# EAGLE design ESP-01_Tamer-u (EAGLE 7.6.0)
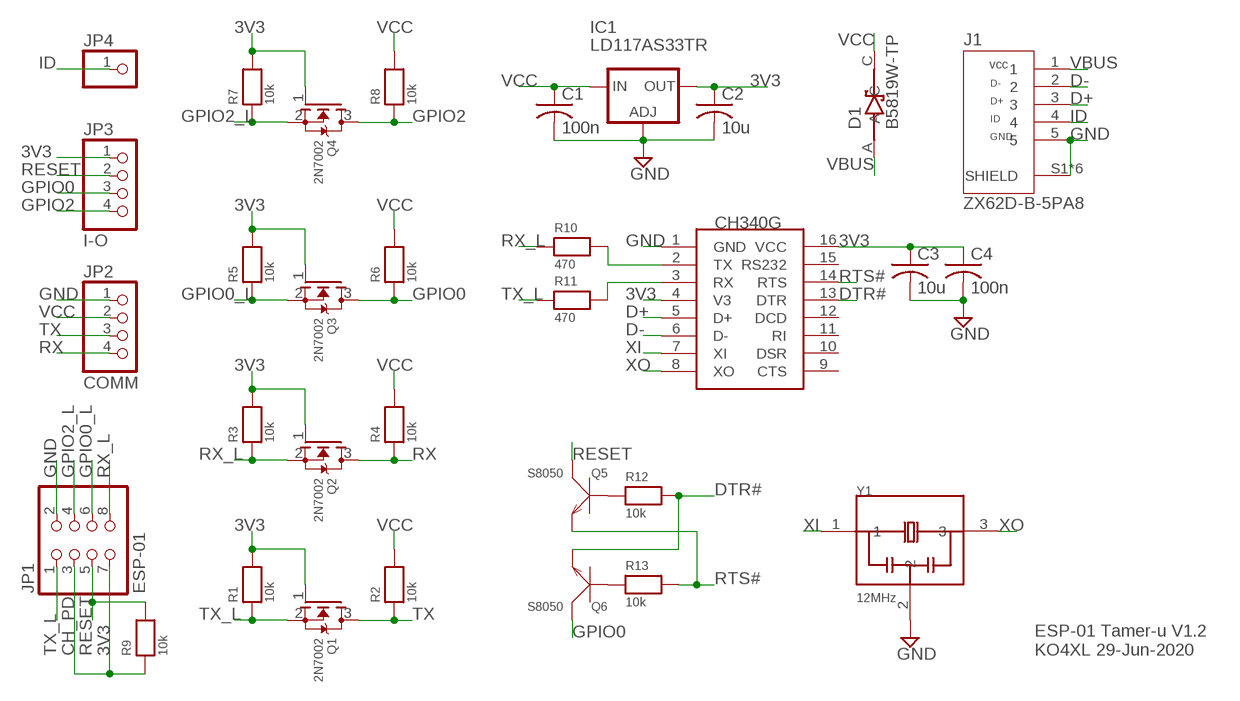
[diagram p0: schematic, sheet 1]

## Parts
C1  100n  C-USC0805K  [C0805K]
C2  10u  C-USC0805K  [C0805K]
C3  10u  C-USC0805K  [C0805K]
C4  100n  C-USC0805K  [C0805K]
D1  B5819W-TP  [SOD3716X135N]
IC1  LD117AS33TR  [SOT223]
IC2  CH340G  [SOIC16]
J1  ZX62D-B-5PA8  [HIROSE_ZX62D-B-5PA8]
JP1  ESP-01  PINHD-2X4  [2X04]
JP2  COMM  HEADER-1X4ROUND  [1X04_ROUND]
JP3  I-O  HEADER-1X4ROUND  [1X04_ROUND]
JP4  HEADER-1X1ROUND  [1X01_ROUND]
Q1  2N7002  MOSFET-NWIDE  [SOT23-WIDE]
Q2  2N7002  MOSFET-NWIDE  [SOT23-WIDE]
Q3  2N7002  MOSFET-NWIDE  [SOT23-WIDE]
Q4  2N7002  MOSFET-NWIDE  [SOT23-WIDE]
Q5  S8050  SMD-TRANSISTORS-NPN-25V-500MW-S8050(SOT-23)  [SOT-23]
Q6  S8050  SMD-TRANSISTORS-NPN-25V-500MW-S8050(SOT-23)  [SOT-23]
R1  10k  RESISTOR0805_NOTHERMALS  [0805_NOTHERMALS]
R2  10k  RESISTOR0805_NOTHERMALS  [0805_NOTHERMALS]
R3  10k  RESISTOR0805_NOTHERMALS  [0805_NOTHERMALS]
R4  10k  RESISTOR0805_NOTHERMALS  [0805_NOTHERMALS]
R5  10k  RESISTOR0805_NOTHERMALS  [0805_NOTHERMALS]
R6  10k  RESISTOR0805_NOTHERMALS  [0805_NOTHERMALS]
R7  10k  RESISTOR0805_NOTHERMALS  [0805_NOTHERMALS]
R8  10k  RESISTOR0805_NOTHERMALS  [0805_NOTHERMALS]
R9  10k  RESISTOR0805_NOTHERMALS  [0805_NOTHERMALS]
R10  470  RESISTOR0805_NOTHERMALS  [0805_NOTHERMALS]
R11  470  RESISTOR0805_NOTHERMALS  [0805_NOTHERMALS]
R12  10k  RESISTOR0805_NOTHERMALS  [0805_NOTHERMALS]
R13  10k  RESISTOR0805_NOTHERMALS  [0805_NOTHERMALS]
Y1  12MHz  CSTCE8M00G55-R0  [OSC_CSTCE8M00G55-R0]

## Nets
3V3: C2.1 C3.1 C4.1 IC1.4(OUT) IC2.4(V3) IC2.16(VCC) JP1.3 JP1.7 JP3.1 Q1.1(G) Q2.1(G) Q3.1(G) Q4.1(G) R1.2 R3.2 R5.2 R7.2 R9.1
D+: IC2.5(D+) J1.3
D-: IC2.6(D-) J1.2
DTR#: IC2.13(DTR) Q6.2(E) R12.2
GND: C1.2 C2.2 C3.2 C4.2 IC1.1(ADJ) IC2.1(GND) J1.5 J1.S1(SHIELD) J1.S2(SHIELD) J1.S3(SHIELD) J1.S4(SHIELD) J1.S5(SHIELD) J1.S6(SHIELD) JP1.2 JP2.1 Y1.2
GPIO0: JP3.3 Q3.3(D) Q6.3(C) R6.1
GPIO0_L: JP1.6 Q3.2(S) R5.1
GPIO2: JP3.4 Q4.3(D) R8.1
GPIO2_L: JP1.4 Q4.2(S) R7.1
ID: J1.4 JP4.1
N$1: Q5.1(B) R12.1
N$2: Q6.1(B) R13.1
N$3: IC2.2(TX) R10.2
N$4: IC2.3(RX) R11.2
RESET: JP1.5 JP3.2 Q5.3(C) R9.2
RTS#: IC2.14(RTS) Q5.2(E) R13.2
RX: JP2.4 Q2.3(D) R4.1
RX_L: JP1.8 Q2.2(S) R3.1 R10.1
TX: JP2.3 Q1.3(D) R2.1
TX_L: JP1.1 Q1.2(S) R1.1 R11.1
VBUS: D1.A J1.1
VCC: C1.1 D1.C IC1.3(IN) JP2.2 R2.2 R4.2 R6.2 R8.2
XI: IC2.7(XI) Y1.1
XO: IC2.8(XO) Y1.3
Unconnected: IC2.9(CTS) IC2.10(DSR) IC2.11(RI) IC2.12(DCD) IC2.15(RS232)

## Notes on the sheet
- CH_PD
- ESP-01 Tamer-u V1.2
  KO4XL 29-Jun-2020

## Library data of the parts
C1-C4 = rcl:C-US: CAPACITOR, American symbol
D1 = SnapEDA:B5819W-TP: Diode Schottky 20v 1a Sod123; AVAILABILITY: Unavailable; DESCRIPTION: Diode Schottky 20v 1a Sod123; MF: Micro Commercial; MP: B5819W-TP; PACKAGE: SOD-123 MCC; PRICE: None
IC1 = v-reg:LD117A?*: Low drop fixed and adjustable positive voltage regulators 1 A Source: http://www.st.com/stonline/products/literature/ds/7194/ld1117axx.pdf
IC2 = ch340g:CH340G
J1 = ZX62D-B-5PA8:ZX62D-B-5PA8: CONN RCPT USB; AVAILABILITY: Unavailable; DESCRIPTION: USB - micro B USB 2.0 Receptacle Connector 5 Position Surface Mount, Right Angle; Through Hole; MF: Hirose; MP: ZX62D-B-5PA8; PACKAGE: None; PRICE: None
JP1 = pinhead:PINHD-2X4: PIN HEADER
JP2 JP3 = microbuilder:HEADER-1X4: PIN HEADER
JP4 = microbuilder:HEADER-1X1: PIN HEADER
Q1-Q4 = microbuilder:MOSFET-N: N-Channel Mosfet LEGEND VDS: Voltage Drain-Source ID: Drain Current RDS(ON): Drain-Source On-State Resistance VGS(TH): Gate-Source Threshold Voltage CISS: Drain-Source Input Capacitance SOT-23 Name VDS ID RDS(ON) VGS(TH) CISS Order Number 2N7002E 60V 260mA 2.5 Ohm 2.5V @ 250uA 26.7pF @ 25V 2N7002ET1GOSTR-ND BSH103 30V 850mA 400 mOhm 400mV @ 1mA 83pF @ 24V BSH103,235-ND BSS138 60V 320mA 1.6 Ohm 1.5V @ 250uA 50pF @ 10V Mouser: 771-BSS138PW115 DMN2075U-7 20V 4.2A 38 mOhm 1V @ 250 uA 594.3pF @ 10V DMN2075U-7DICT-ND * BSS138 good choice for I2C level-shifting
Q5 Q6 = SnapEDA:SMD-TRANSISTORS-NPN-25V-500MW-S8050(SOT-23): 305010017; AVAILABILITY: Unavailable; DESCRIPTION: SMD Transistors NPN 25V-500mW;; MF: JCET; MP: S8050; PACKAGE: SOT-23-3 JCET; PRICE: None
R1-R13 = microbuilder:RESISTOR: Resistors 0402 - 0402 Surface Mount Package 22 Ohm 1% 1/16W [Digikey: 311-22.0LRTR-ND] 33 Ohm 5% 1/16W 1.0K 5% 1/16W 1.5K 5% 1/16W 2.0K 1% 1/16W 10.0K 1% 1/16W [Digikey: 311-10.0KLRTR-ND] 10.0K 5% 1/16W [Digikey: RMCF0402JT10K0TR-ND] 12.1K 1% 1/16W [Digikey: 311-22.0LRTR-ND] 100.0K 5% 1/16W 0603 - 0603 Surface Mount Package 0 Ohm 1/10 Watt 1% Resistor 15 Ohm 1/10 Watt 1% Resistor 33 Ohm 1/10 Watt 1% Resistor 49.9 Ohm 1/10 Watt 1% Resistor 100 Ohm 1/10 Watt 1% Resistor 150 Ohm 1/10 Watt 1% Resistor 240 Ohm 1/10 Watt 1% Resistor 390 Ohm 1/10 Watt 1% Resistor 560 Ohm 1/10 Watt 1% Resistor 680 Ohm 1/10 Watt 1% Resistor 750 Ohm 1/10 Watt 1% Resistor 1.0K Ohm 1/10 Watt 1% Resistor 1.5K Ohm 1/10 Watt 1% Resistor 2.0K Ohm 1/10 Watt 1% Resistor 2.2K Ohm 1/10 Watt 1% Resistor 3.3K Ohm 1/10 Watt 1% Resistor 4.7K Ohm 1/10 Watt 1% Resistor 10.0K Ohm 1/10 Watt 1% Resistor 12.0K Ohm 1/10 Watt 1% Resistor 12.1K Ohm 1/10 Watt 1% Resistor 20.0K Ohm 1/10 Watt 1% Resistor 33.0K Ohm 1/10 Watt 1% Resistor 100.0K Ohm 1/10 Watt 1% Resistor 0805 - 0805 Surface Mount Package 0 Ohm 1/8 Watt 1% Resistor 33 Ohm 1/8 Watt 1% Resistor 100 Ohm 1/8 Watt 1% Resistor 150 Ohm 1/8 Watt 1% Resistor 200 Ohm 1/8 Watt 1% Resistor 240 Ohm 1/8 Watt 1% Resistor 330 Ohm 1/8 Watt 1% Resistor 390 Ohm 1/8 Watt 1% Resistor 470 Ohm 1/8 Watt 1% Resistor 1.0K Ohm 1/8 Watt 1% Resistor 1.5K Ohm 1/8 Watt 1% Resistor 2.0K Ohm 1/8 Watt 1% Resistor 4.7K Ohm 1/8 Watt 1% Resistor 5.1K Ohm 1/8 Watt 1% Resistor 5.6K Ohm 1/8 Watt 1% Resistor 10.0K Ohm 1/8 Watt 1% Resistor 22.0K Ohm 1/8 Watt 1% Resistor 33.0K Ohm 1/8 Watt 1% Resistor 100K Ohm 1/8 Watt 1% Resistor 1206 - 1206 Surface Mount Package 2012 - 2010 Surface Mount Package 0.11 Ohm 1/2 Watt 1% Resistor - Digikey: RHM.11UCT-ND
Y1 = SnapEDA:CSTCE8M00G55-R0: SMD Crystal 8MHz -0.3%-150R; AVAILABILITY: Unavailable; DESCRIPTION: Ceramic Resonator 8MHz ??0.5% _Tol_ ??0.2% _Stability_ 33pF 40Ohm 3-Pin CSMD T/R; MF: Murata; MP: CSTCE8M00G55-R0; PACKAGE: SMD-3 Murata; PRICE: None

## Net classes
0 default: width 0.254 mm, drill 0.254 mm, clearance 0.254 mm

## Board
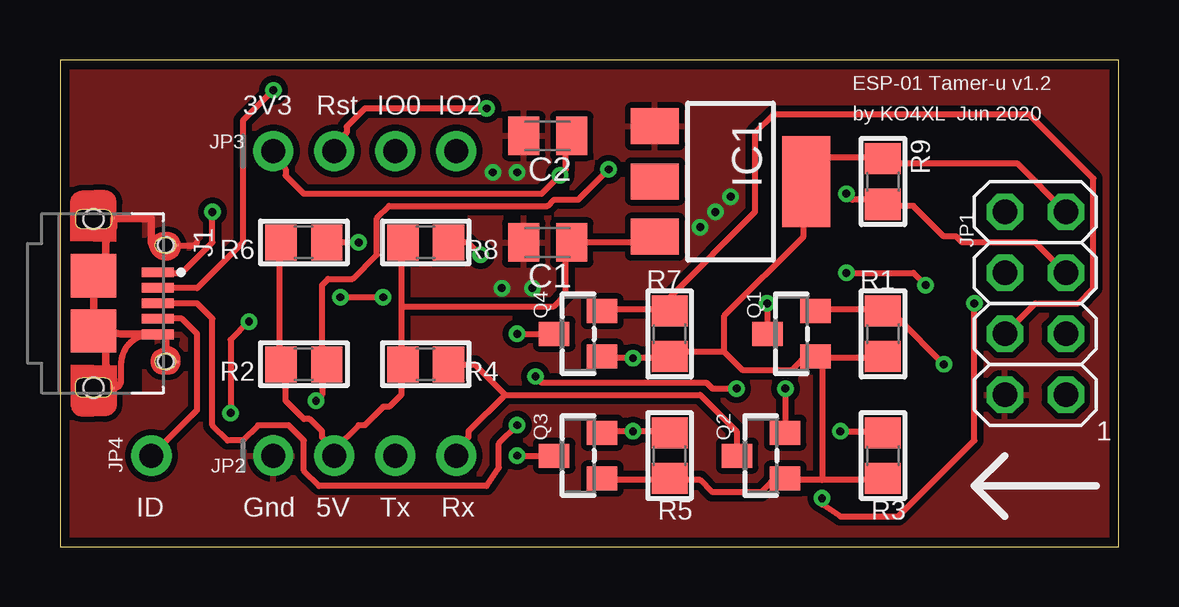
[diagram p1: board, top side]
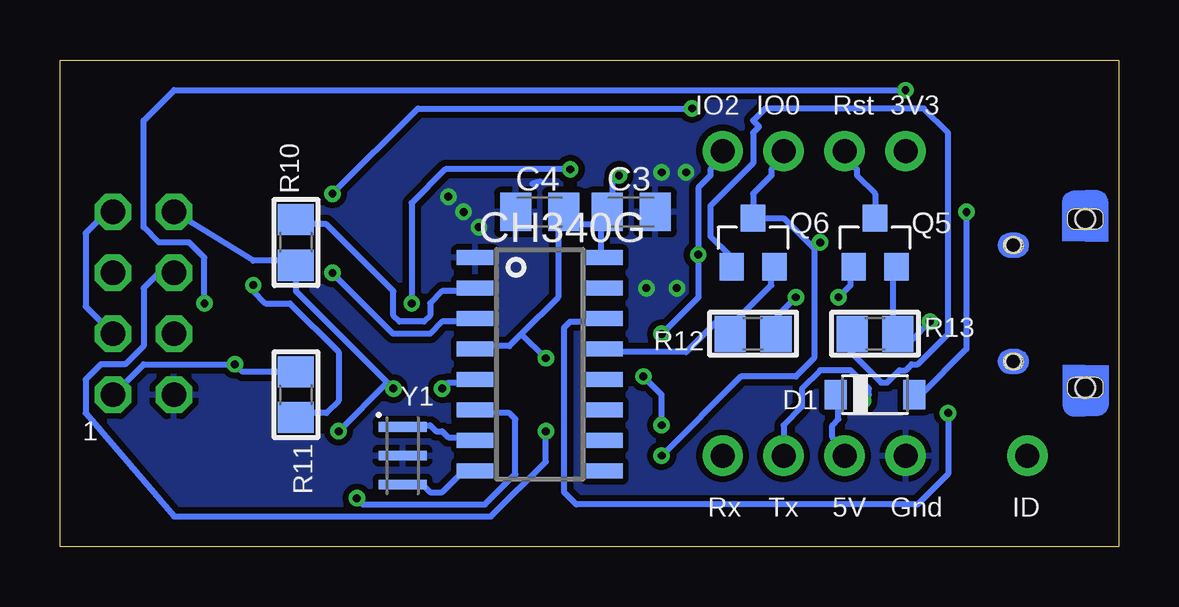
[diagram p2: board, bottom side, seen from below]

Size 44.12 x 20.31 mm. Coordinates in mm from the lower left corner, seen from the top.
Outline: 0,0 44.12,0 44.12,20.31 0,20.31 0,0
Copper layers (1*16): Top 0.0356mm / dielectric 1.5011mm / Bottom 0.0356mm
Design rules "OSHPark": minimum track width 6mil, minimum drill 13mil, track to track 6mil, track to pad 6mil, pad to pad 6mil, via to via 6mil, smd to smd 6mil, copper to edge 15mil, drill to drill 6mil, minimum pad ring 7mil, minimum via ring 7mil, stop-mask expansion 4mil, vias tented up to drill 0mil, thermal gap 10mil

### Footprints (pad centres in the part's own frame; a part is rotated, then mirrored left to right if it is on the bottom)
C0805K = smd 1.3 x 1.6: 1 -1,0; 2 1,0
SOD3716X135N = smd 0.914 x 1.219: A 1.638,0; C -1.638,0
SOT223 = smd 1.5 x 2: 1 -2.3,-3.15; 2 0,-3.15; 3 2.3,-3.15 | smd 3.8 x 2: 4 0,3.15
SOIC16 = smd 0.635 x 1.524: 1 -4.445,-2.695; 2 -3.175,-2.695; 3 -1.905,-2.695; 4 -0.635,-2.695; 5 0.635,-2.695; 6 1.905,-2.695; 7 3.175,-2.695; 8 4.445,-2.695; 9 4.445,2.695; 10 3.175,2.695; 11 1.905,2.695; 12 0.635,2.695; 13 -0.635,2.695; 14 -1.905,2.695; 15 -3.175,2.695; 16 -4.445,2.695
HIROSE_ZX62D-B-5PA8 = smd 0.4 x 1.35: 1 -1.3,2.675; 2 -0.65,2.675; 3 0,2.675; 4 0.65,2.675; 5 1.3,2.675 | smd 0.1 x 0.1: S1 -2.413,3.508; S2 2.437,3.508; S3 -3.538,0.839; S4 3.538,0.839 | smd 1.8 x 1.9: S5 -1.15,0; S6 1.15,0 | hole 0.65: -2.425,3; 2.425,3 | hole 0.825: -3.513,0; 3.513,0
2X04 = drill 1.016 octagon: 1 -3.81,-1.27; 2 -3.81,1.27; 3 -1.27,-1.27; 4 -1.27,1.27; 5 1.27,-1.27; 6 1.27,1.27; 7 3.81,-1.27; 8 3.81,1.27
1X04_ROUND = drill 1 pad 1.676: 1 -3.81,0; 2 -1.27,0; 3 1.27,0; 4 3.81,0
1X01_ROUND = drill 1 pad 1.676: 1 0,0
SOT23-WIDE = smd 1 x 1.27: 1 -0.95,-1; 2 0.95,-1; 3 0,1
SOT-23 = smd 1.016 x 1.143: 1 -0.889,-1.016; 2 0.889,-1.016; 3 0,1.016
0805_NOTHERMALS = smd 1.3 x 1.5: 1 -0.95,0; 2 0.95,0
OSC_CSTCE8M00G55-R0 = smd 0.4 x 2: 1 -1.2,0; 2 0,0; 3 1.2,0

### Placement (x,y rotation side)
C1  20.32,12.7 180 top
C2  20.32,17.14 180 top
C3  20.32,13.97 0 bottom
C4  24.13,13.97 180 bottom
D1  10.16,6.35 0 bottom
IC1  27.94,15.24 270 top
IC2  24.13,7.62 270 bottom
J1  1.4,10.16 270 top
JP1  40.64,10.16 90 top
JP2  12.7,3.81 0 top
JP3  12.7,16.51 0 top
JP4  3.81,3.81 0 top
Q1  30.48,8.89 90 top
Q2  29.21,3.81 90 top
Q3  21.59,3.81 90 top
Q4  21.59,8.89 90 top
Q5  10.16,12.7 0 bottom
Q6  15.24,12.7 0 bottom
R1  34.29,8.89 270 top
R2  10.16,7.62 180 top
R3  34.29,3.81 270 top
R4  15.24,7.62 180 top
R5  25.4,3.81 270 top
R6  10.16,12.7 180 top
R7  25.4,8.89 270 top
R8  15.24,12.7 180 top
R9  34.29,15.24 270 top
R10  34.29,12.7 90 bottom
R11  34.29,6.35 270 bottom
R12  15.24,8.89 180 bottom
R13  10.16,8.89 0 bottom
Y1  29.84,3.81 270 bottom

### Tracks (layer width: path | path; a pad name or v marks a point on that pad's centre or on a via)
3V3  (via drill 0.33)
  Top 0.254: JP3.1 8.89,16.26 9.4,15.75 9.4,15.49 10.16,14.73 20.07,14.73 v20.83,15.49 21.08,15.75 21.08,17.02 C2.1 | 25.4,2.79 22.61,2.79 Q3.1 | 31.75,2.79 34.29,2.79 R3.2 | 31.75,2.79 30.23,2.79 Q2.1 29.97,3.05 29.21,2.29 27.18,2.29 26.67,2.79 25.4,2.79 | 25.4,2.79 R5.2 | 30.99,15.24 32,16.26 34.29,16.26 R9.1 34.29,16 39.88,16 JP1.7 | Q4.1 22.61,7.87 v23.88,7.87 25.4,7.87 R7.2 25.4,8.13 27.69,8.13 | 31.75,7.87 34.29,7.87 R1.2 | 31.75,7.87 31.5,7.87 Q1.1 | 27.69,8.13 28.45,7.37 30.48,7.37 31.24,8.13 Q1.1 | 30.99,15.24 30.99,12.95 27.69,9.65 27.69,8.13 | 30.99,15.24 IC1.4 | 31.75,7.87 31.75,2.79 | 31.75,7.87 Q1.1
  Bottom 0.254: 21.59,13.46 21.59,13.72 21.34,13.97 C3.1 | 21.59,13.46 21.59,12.19 IC2.16 | 24.89,8.89 23.37,10.41 23.37,13.46 | 24.89,8.89 25.4,8.38 26.67,8.38 IC2.4 | 23.37,13.46 23.37,13.97 C4.1 23.37,13.46 | 23.37,13.46 21.59,13.46 | 21.59,13.46 C3.1 | JP1.3 43.05,10.03 43.05,13.08 42.16,13.97 JP1.7 | v23.88,7.87 24.89,8.89 | v20.83,15.49 21.08,15.24 21.08,13.97 C3.1
D+  (via drill 0.33)
  Top 0.254: v28.19,6.6 27.18,6.6 26.92,6.86 20.07,6.86 v19.81,7.11 | v19.05,5.08 18.29,4.32 18.29,3.3 17.78,2.54 10.79,2.54 10.16,3.17 10.16,4.45 9.53,5.08 8.26,5.08 7.62,4.45 6.99,4.45 6.35,5.08 6.35,9.53 5.71,10.16 J1.3
  Bottom 0.254: v28.19,6.6 27.94,6.86 26.92,6.86 IC2.5 | v19.81,7.11 19.05,6.35 v19.05,5.08
D-  (via drill 0.33)
  Top 0.254: v31.75,2.03 31.75,1.78 32.51,1.27 34.92,1.27 38.1,4.45 v38.1,10.16 | v8.89,19.05 7.62,17.78 7.62,12.7 5.71,10.79 4.45,10.79 J1.2
  Bottom 0.254: v31.75,2.03 31.5,1.78 26.42,1.78 25.15,3.05 25.15,5.33 25.4,5.59 26.67,5.59 IC2.6 | v8.89,19.05 39.37,19.05 40.64,17.78 40.64,13.34 40.01,12.7 38.73,12.7 38.1,12.06 v38.1,10.16
DTR#
  Bottom 0.254: 16,9.4 14.48,10.92 14.48,11.68 Q6.2 | 16,9.4 16,8.89 R12.2 16,9.4 | 16,9.4 16.76,9.4 18.03,8.13 21.34,8.13 IC2.13
GND  (via drill 0.33 pad 0.25)
  Top 0.254: 5.71,12.7 5.59,12.57 J1.S1 arc-96 4.45,12.06 arc-90 3.81,12.7 | J1.S2 4.91,7.79 arc90 4.45,8.26 4.45,8.49 arc90 J1.5 3.78,8.86 arc90 2.54,7.62 2.54,6.93 arc-90 J1.S4
  Top 0.305: J1.S5 J1.S6 | 1.91,9.01 1.91,7.62 2.24,6.99 J1.S4 | 1.91,11.31 1.91,12.7 2.24,13.34 J1.S3 3.81,13.7 3.81,12.7 | 1.78,9.01 2.54,8.89 3.81,8.89
  Top 0.406: J1.S6 1.78,9.01 1.91,9.01 | J1.S5 1.91,11.31
  Bottom 0.254: 24.13,15.24 24.43,15.15
  other vias: 26.67,13.34 27.3,13.97 27.94,14.61 18.41,10.79 19.68,10.79 18.03,15.62 19.05,15.62
  pour Top: 0,0 44.45,0 44.45,20.32 0,20.32
  pour Bottom: 0,-1.27 44.45,-1.27 44.45,20.32 0,20.32
GPIO0  (via drill 0.33)
  Top 0.254: v19.05,3.81 Q3.3 | v12.45,12.7 R6.1
  Bottom 0.254: JP3.3 13.97,16.26 14.48,15.75 14.48,15.49 15.24,14.73 Q6.3 13.97,13.72 12.7,12.45 | v19.05,3.81 15.75,7.11 13.46,7.11 12.7,7.87 12.7,12.45 | 12.7,12.45 v12.45,12.7
GPIO0_L  (via drill 0.33)
  Top 0.254: Q3.2 22.61,4.83 v23.88,4.83 25.4,4.83 R5.1
  Bottom 0.254: v23.88,4.83 23.88,3.56 26.16,1.27 39.37,1.27 43.05,5.59 43.05,6.99 42.42,7.62 41.4,7.62 40.64,8.38 40.64,10.79 40.01,11.43 JP1.6
GPIO2  (via drill 0.33)
  Top 0.254: v19.05,8.89 Q4.3 | R8.1 17.02,12.7 v17.53,12.19
  Bottom 0.254: v19.05,8.89 17.53,10.41 v17.53,12.19 17.53,14.99 17.02,15.49 17.02,15.75 16.51,16.26 JP3.4
GPIO2_L
  Top 0.254: 25.4,9.91 22.61,9.91 Q4.2 | 25.4,9.91 25.4,10.41 28.96,13.97 28.96,17.27 29.72,18.03 40.39,18.03 43.05,15.37 43.05,10.79 42.42,10.16 40.64,10.16 JP1.4 | 25.4,9.91 R7.1
ID
  Top 0.254: JP4.1 5.71,5.71 5.71,8.89 5.08,9.53 4.09,9.53 J1.4
N$1  (via drill 0.33)
  Top 0.254: v13.46,10.41 v11.68,10.41
  Bottom 0.254: v11.68,10.41 11.18,10.92 11.18,11.68 Q5.1 | v13.46,10.41 14.22,9.65 14.22,8.89 R12.1
N$2
  Bottom 0.254: Q6.1 16.26,11.68 16.26,12.19 17.02,12.95 17.02,14.22 15.24,16 15.24,17.27 14.99,17.53 15.24,17.78 14.73,18.29 8.13,18.29 7.11,17.27 7.11,8.89 8.38,7.62 8.64,7.62 8.89,7.37 9.14,7.37 9.65,6.86 9.91,6.86 11.18,8.13 11.18,8.89 R13.1
N$3
  Bottom 0.254: R10.2 34.29,13.46 33.02,13.46 30.23,10.67 30.23,9.65 29.97,9.4 28.96,9.4 28.7,9.65 28.7,10.16 28.19,10.67 26.92,10.67 IC2.2
N$4  (via drill 0.33)
  Top 0.254: v36.07,10.92 35.56,11.43 v32.77,11.43
  Bottom 0.254: v36.07,10.92 36.07,10.67 35.56,10.16 34.54,10.16 32.51,8.13 32.51,6.1 33.02,5.59 34.29,5.59 R11.2 | v32.77,11.43 30.23,8.89 28.7,8.89 28.19,9.4 26.92,9.4 IC2.3
RESET  (via drill 0.33)
  Top 0.254: JP3.2 11.43,16.76 11.94,17.27 11.94,17.53 12.7,18.29 v17.78,18.29 | v32.77,14.73 33.02,14.48 34.29,14.48 R9.2 34.29,14.22 35.56,14.22 36.83,12.95 37.34,12.95 37.59,12.7 40.64,12.7 JP1.5
  Bottom 0.254: Q5.3 10.16,14.73 10.92,15.49 10.92,15.75 11.43,16.26 JP3.2 | v17.78,18.29 29.21,18.29 v32.77,14.73
RTS#  (via drill 0.33)
  Top 0.254: v7.11,5.59 7.11,8.64 v7.87,9.4
  Bottom 0.254: Q5.2 9.4,11.68 9.4,8.89 R13.2 9.14,8.89 8.89,8.64 8.64,8.64 v7.87,9.4 | v7.11,5.59 7.11,3.05 8.38,1.78 22.61,1.78 23.11,2.29 23.11,9.14 22.86,9.4 21.59,9.4 IC2.14
RX
  Top 0.254: 18.54,6.35 26.67,6.35 28.19,4.83 28.19,3.81 Q2.3 | 18.54,6.35 17.27,7.62 R4.1 | JP2.4 16.51,4.06 17.02,4.57 17.02,4.83 18.54,6.35
RX_L  (via drill 0.33)
  Top 0.254: v30.23,6.6 30.23,4.83 Q2.2 | v32.51,4.83 34.29,4.83 R3.1
  Bottom 0.254: 30.48,6.86 34.29,10.67 R10.1 34.29,11.94 36.07,11.94 JP1.8 | 30.48,6.86 v30.23,6.6 | 30.48,6.86 v32.51,4.83
TX  (via drill 0.33)
  Top 0.254: v29.46,10.16 29.46,8.89 Q1.3 | v22.86,15.75 21.59,14.48 20.57,14.48 20.32,14.22 13.72,14.22 13.21,13.72 13.21,12.19 12.19,11.18 11.18,11.18 10.92,10.92 10.92,7.62 | v10.67,6.1 10.92,6.35 10.92,7.62 | 10.92,7.62 R2.1
  Bottom 0.254: v29.46,10.16 29.46,14.35 28.07,15.75 v22.86,15.75 | JP2.3 13.97,5.08 13.21,5.84 13.21,6.6 12.45,7.37 11.18,7.37 10.41,6.6 10.41,6.35 v10.67,6.1
TX_L  (via drill 0.33 pad 0.25)
  Top 0.254: v36.83,7.62 34.92,9.53 34.6,9.53 R1.1 34.29,9.91 31.5,9.91 Q1.2
  Bottom 0.254: JP1.1 40.64,7.62 v36.83,7.62 36.51,7.3 R11.1
VBUS  (via drill 0.33)
  Top 0.254: v6.35,13.97 6.35,12.7 5.08,11.43 4.45,11.43 J1.1
  Bottom 0.254: v6.35,13.97 6.35,8.26 8.26,6.35 D1.A
VCC
  Top 0.254: R6.2 9.14,12.7 9.14,7.62 R2.2 9.4,7.62 9.4,6.1 10.16,5.33 10.41,5.33 10.92,4.83 10.92,4.57 11.43,4.06 | IC1.3 24.64,12.7 C1.1 21.08,12.7 21.08,10.54 20.57,10.03 14.22,10.03 | 14.22,10.03 14.22,12.7 R8.2 | 14.22,10.03 14.22,7.62 | 11.43,4.06 12.45,5.08 12.7,5.08 13.46,5.84 13.72,5.84 14.22,6.35 14.22,7.62 | 11.43,4.06 JP2.2 | 14.22,7.62 R4.2
  Bottom 0.254: JP2.2 11.43,4.06 11.94,4.57 11.94,5.08 11.68,5.33 11.68,6.35 D1.C
XI
  Bottom 0.254: IC2.7 26.92,4.57 27.94,4.57 28.19,4.83 28.45,4.83 28.7,5.08 29.72,5.08 Y1.1
XO
  Bottom 0.254: IC2.8 26.92,3.05 27.43,3.05 28.19,2.29 28.7,2.29 28.96,2.54 29.72,2.54 Y1.3

### Text on the board
tPlace: ESP-01 Tamer-u v1.2 | 3V3 | Rst | IO0 | IO2 | by KO4XL Jun 2020 | 1 | ID | Gnd | 5V | Tx | Rx
bPlace: 3V3 | Rst | IO0 | IO2 | 1 | ID | Gnd | 5V | Tx | Rx